# EAGLE design Booster1 (EAGLE 7.5.0)
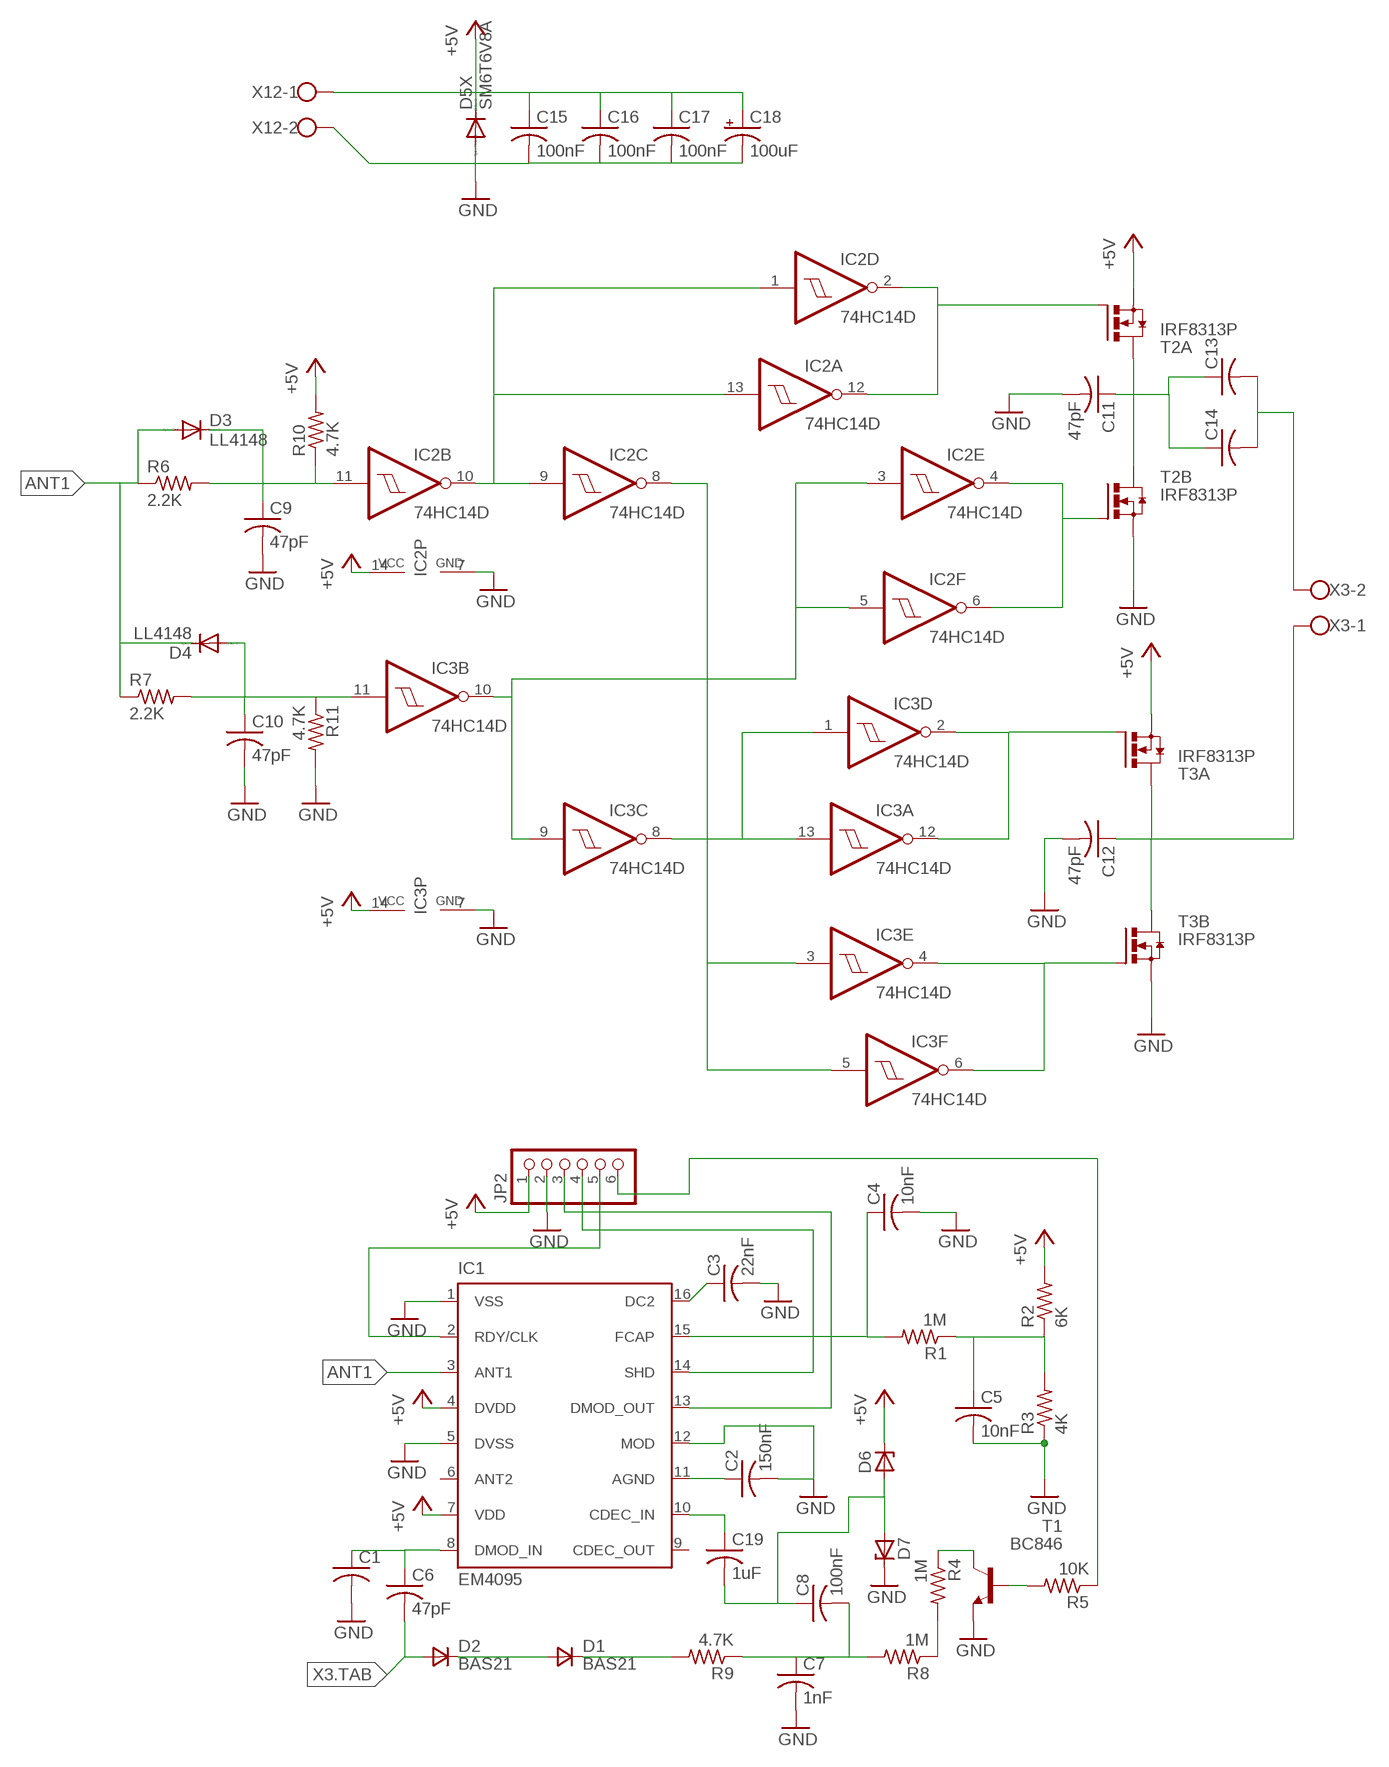
[diagram p0: schematic, sheet 1]

## Parts
C1  C-USC1206K  [C1206K]
C2  150nF  C-USC1206  [C1206]
C3  22nF  C-USC1206K  [C1206K]
C4  10nF  C-USC1206K  [C1206K]
C5  10nF  C-USC1206K  [C1206K]
C6  47pF  C-US050-025X075  [C050-025X075]
C7  1nF  C-US050-025X075  [C050-025X075]
C8  100nF  C-US050-025X075  [C050-025X075]
C9  47pF  C-USC1206  [C1206]
C10  47pF  C-USC1206  [C1206]
C11  47pF  C-USC1206  [C1206]
C12  47pF  C-USC1206  [C1206]
C13  C-US050-025X075  [C050-025X075]
C14  C-US050-025X075  [C050-025X075]
C15  100nF  C-USC1206  [C1206]
C16  100nF  C-USC1206  [C1206]
C17  100nF  C-USC1206  [C1206]
C18  100uF  CPOL-USCT7343  [CT7343]
C19  1uF  C-US050-025X075  [C050-025X075]
D1  BAS21  VAR2SOT23  [SOT-23]
D2  BAS21  VAR2SOT23  [SOT-23]
D3  LL4148  DIODE-SOD106-R  [SOD106-R]
D4  LL4148  DIODE-SOD106-R  [SOD106-R]
D5X  SM6T6V8A  [SMB]
D6  ZENER-DIODESMB  [SMB]
D7  ZENER-DIODESMB  [SMB]
IC1  EM4095  [SO16]
IC2  74HC14D  [SO14]
IC3  74HC14D  [SO14]
JP2  PINHD-1X6  [1X06]
R1  1M  R-US_R1206  [R1206]
R2  6K  R-US_R1206  [R1206]
R3  4K  R-US_R1206  [R1206]
R4  1M  R-US_R1206  [R1206]
R5  10K  R-US_R1206  [R1206]
R6  2.2K  R-US_R1206  [R1206]
R7  2.2K  R-US_R1206  [R1206]
R8  1M  R-US_R1206  [R1206]
R9  4.7K  R-US_R1206  [R1206]
R10  4.7K  R-US_R1206  [R1206]
R11  4.7K  R-US_R1206  [R1206]
T1  BC846  [SOT23]
T2  IRF8313P  [SO-08]
T3  IRF8313P  [SO-08]
X3  W237-102  [W237-102]
X12  W237-102  [W237-102]

## Nets
+5V: C15.1 C16.1 C17.1 C18.+ D5X.C D6.C IC1.4(DVDD) IC1.7(VDD) IC2.14(P:VCC) IC3.14(P:VCC) JP2.1 R2.2 R10.2 T2.3(A:S) T3.3(A:S) X12.1
ANT1: D3.A D4.C IC1.3(ANT1) R6.1 R7.1
BANT2: C12.1 T3.5(A:D) T3.6(A:D) T3.7(B:D) T3.8(B:D) X3.1
DMOD: IC1.13(DMOD_OUT) JP2.3
GND: C1.2 C2.2 C3.2 C4.2 C5.2 C7.2 C9.2 C10.2 C11.2 C12.2 C15.2 C16.2 C17.2 C18.- D5X.A D7.C IC1.1(VSS) IC1.5(DVSS) IC1.12(MOD) IC2.7(P:GND) IC3.7(P:GND) JP2.2 R3.1 R11.2 T1.2(E) T2.1(B:S) T3.1(B:S) X12.2
N$1: C10.1 D4.A IC3.11(B:I) R7.2 R11.1
N$2: IC2.1(D:I) IC2.9(C:I) IC2.10(B:O) IC2.13(A:I)
N$3: D1.3(A) D2.1(C)
N$4: IC2.8(C:O) IC3.3(E:I) IC3.5(F:I)
N$5: IC2.3(E:I) IC2.5(F:I) IC3.9(C:I) IC3.10(B:O)
N$6: IC2.4(E:O) IC2.6(F:O) T2.2(B:G)
N$7: IC2.2(D:O) IC2.12(A:O) T2.4(A:G)
N$8: IC3.1(D:I) IC3.8(C:O) IC3.13(A:I)
N$9: IC3.2(D:O) IC3.12(A:O) T3.4(A:G)
N$10: IC3.4(E:O) IC3.6(F:O) T3.2(B:G)
N$11: C9.1 D3.C IC2.11(B:I) R6.2 R10.1
N$12: C11.1 C13.1 C14.1 T2.5(A:D) T2.6(A:D) T2.7(B:D) T2.8(B:D)
N$13: D1.1(C) R9.2
N$14: C4.1 IC1.15(FCAP) R1.2
N$15: C2.1 IC1.11(AGND)
N$17: C5.1 R1.1 R2.1 R3.2
N$20: C3.1 IC1.16(DC2)
N$22: C19.1 IC1.10(CDEC_IN)
N$23: C7.1 C8.2 R8.2 R9.1
N$24: R4.2 R8.1
N$25: C8.1 C19.2 D6.A D7.A
N$26: R4.1 T1.3(C)
N$27: R5.2 T1.1(B)
N$28: JP2.6 R5.1
RDY: IC1.2(RDY/CLK) JP2.5
SLP: IC1.14(SHD) JP2.4
X3.TAB: C6.2 C13.2 C14.2 D2.3(A) X3.2
XXX: C1.1 C6.1 IC1.8(DMOD_IN)
Unconnected: IC1.6(ANT2) IC1.9(CDEC_OUT)

## Library data of the parts
C1-C17 C19 = rcl:C-US: CAPACITOR, American symbol
C18 = rcl:CPOL-US: POLARIZED CAPACITOR, American symbol
D1 D2 = zetex:VAR2SOT23: DIODE; OC_FARNELL: unknown; OC_NEWARK: unknown
D3 D4 = diode:DIODE-: DIODE
D5X = diode:SM6T6V8A: DIODE super fast rectifier, 2 A
D6 D7 = diode:ZENER-DIODE: Z-Diode
IC1 = em-microelectronic:EM4095: Read/Write analog front end for 125kHz RFID Basestation Source: http://www.emmicroelectronic.com/webfiles/Product/RFID/DS/EM4095_DS.pdf
IC2 IC3 = 74xx-eu:74*14: Hex schmitt trigger INVERTER
JP2 = pinhead:PINHD-1X6: PIN HEADER
R1-R11 = rcl:R-US_: RESISTOR, American symbol
T1 = transistor:BC846: NPN TRANSISTOR
T2 T3 = transistor-power:IRF8313P: HEXFET(R) Power MOSFET Source: Data sheet <http://www.irf.com/product-info/datasheets/data/irf8313pbf.pdf>
X3 X12 = con-wago-500:W237-102: WAGO SCREW CLAMP; MPN: 237-102; OC_FARNELL: unknown; OC_NEWARK: 70K9898

## Board
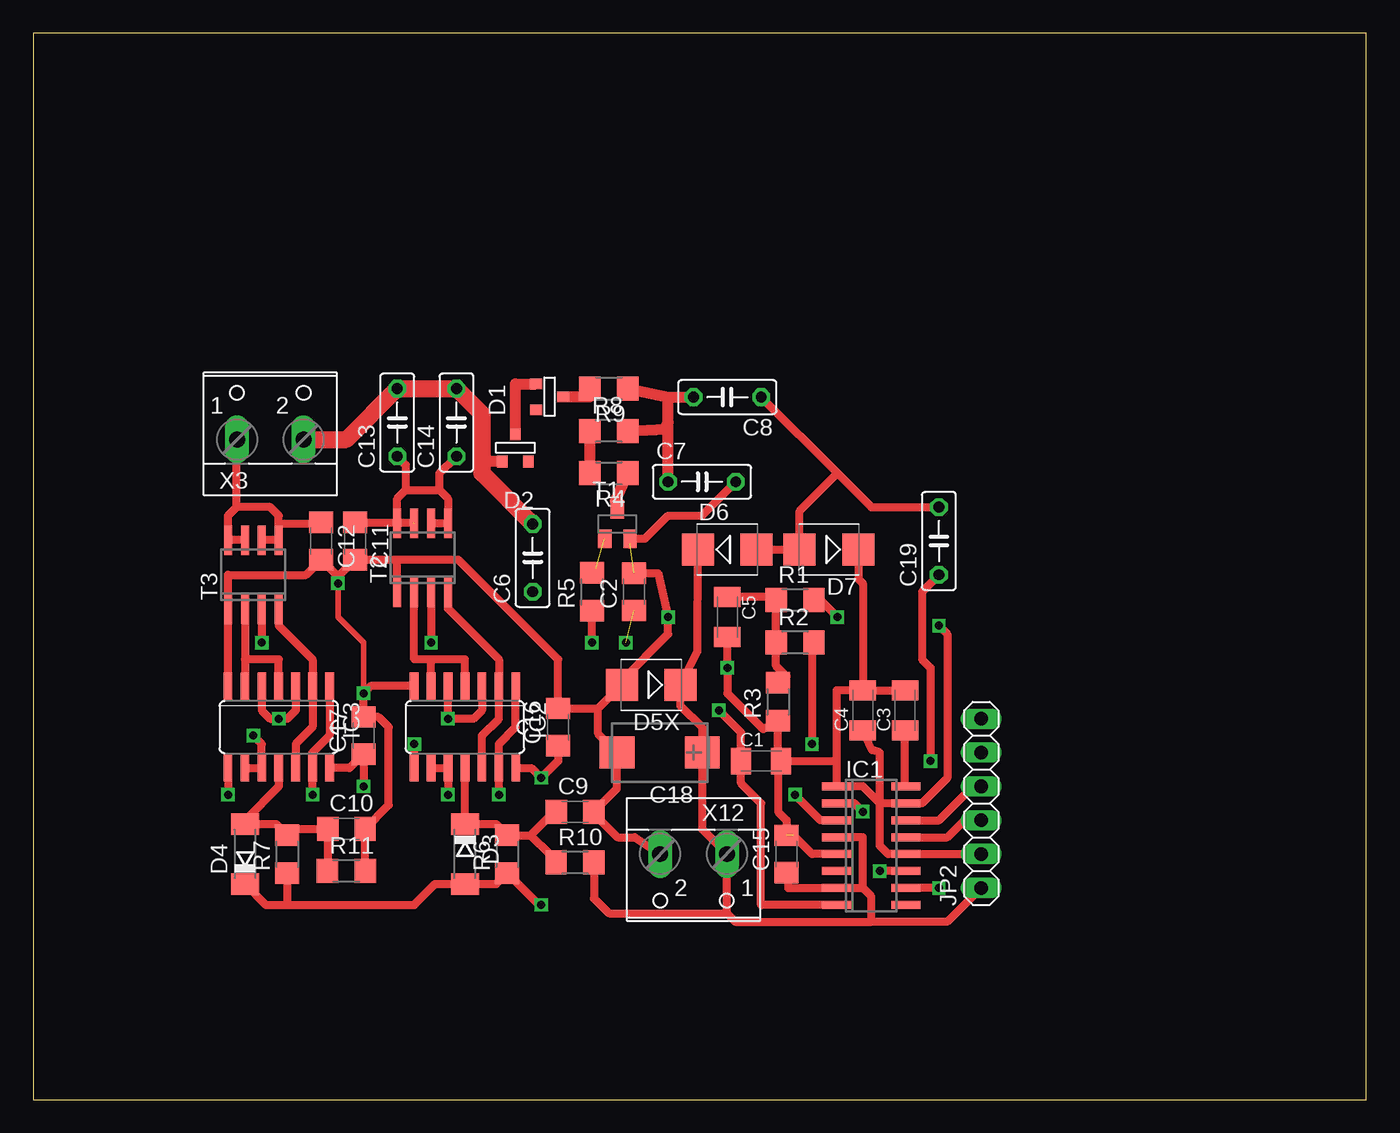
[diagram p1: board, top side]
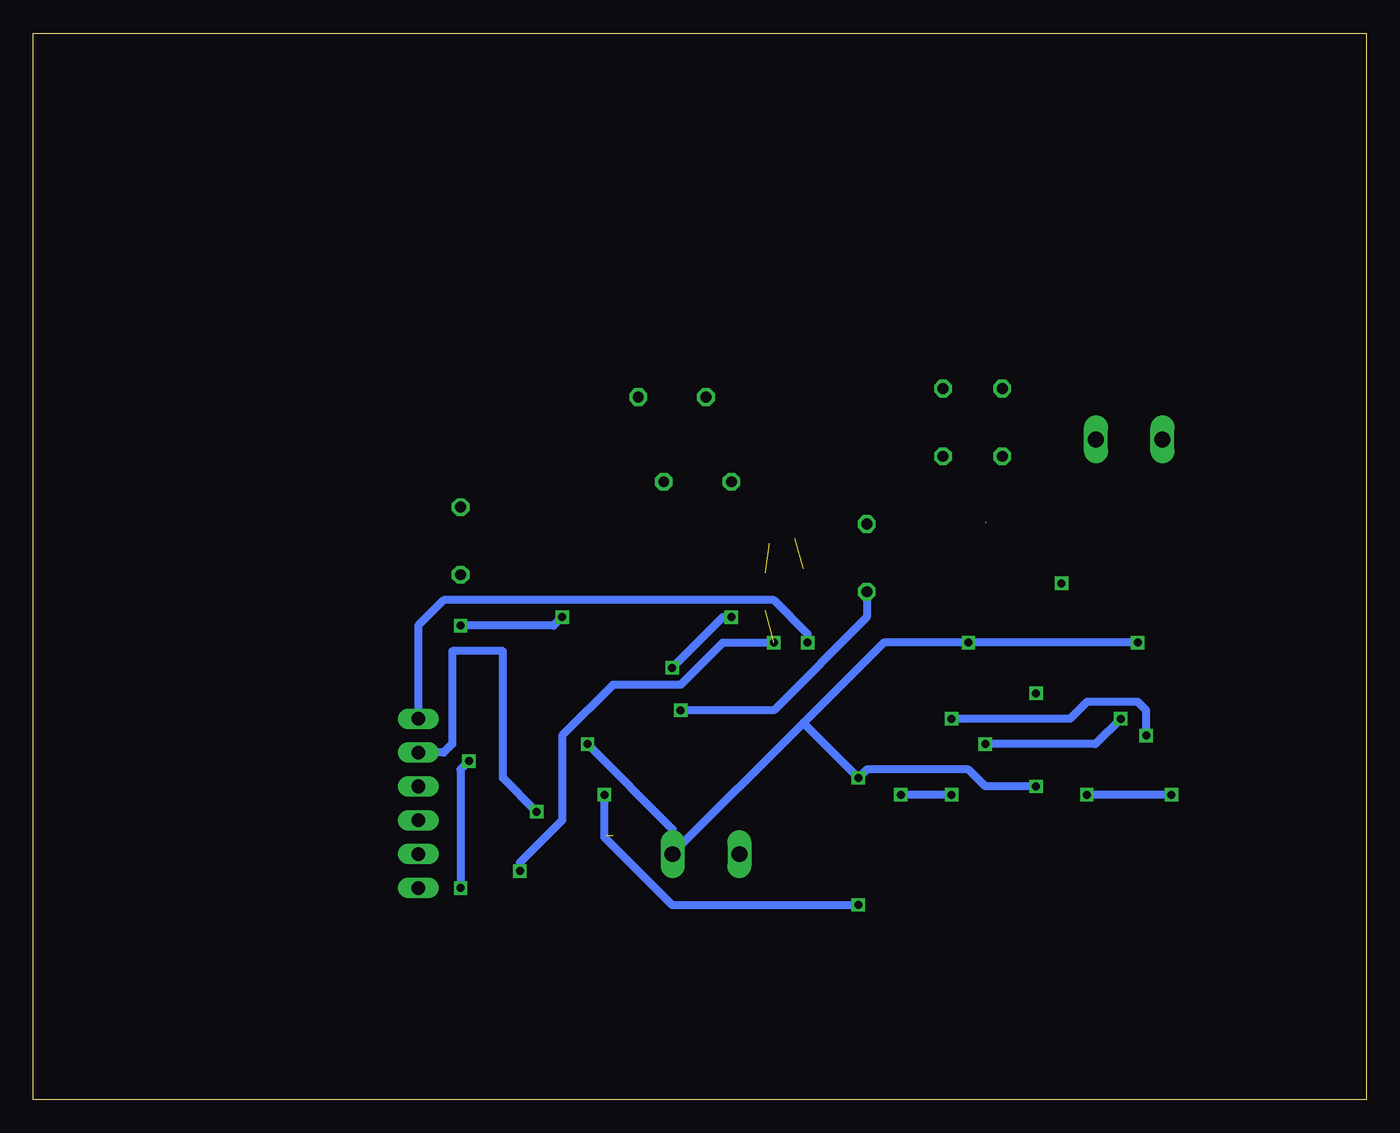
[diagram p2: board, bottom side, seen from below]

Size 100 x 80 mm. Coordinates in mm from the lower left corner, seen from the top.
Outline: 0,0 100,0 100,80 0,80 0,0
Copper layers (1*16): Top 0.035mm / dielectric 1.5mm / Bottom 0.035mm
Design rules "default": minimum track width 10mil, minimum drill 24mil, track to track 8mil, track to pad 8mil, pad to pad 8mil, via to via 8mil, smd to smd 8mil, copper to edge 40mil, drill to drill 8mil, minimum pad ring 10mil, minimum via ring 8mil, stop-mask expansion 4mil, vias tented up to drill 0mil, thermal gap 10mil

### Footprints (pad centres in the part's own frame; a part is rotated, then mirrored left to right if it is on the bottom)
C1206K = smd 1.5 x 2: 1 -1.5,0; 2 1.5,0
C1206 = smd 1.6 x 1.8: 1 -1.4,0; 2 1.4,0
C050-025X075 = drill 0.813 octagon: 1 -2.54,0; 2 2.54,0
CT7343 = smd 2.6 x 2.4: + -3.2,0; - 3.2,0
SOT-23 = smd 0.787 x 0.889: 1 0.025,-1.016; 2 -0.94,1.016; 3 0.991,1.016
SOD106-R = smd 1.6 x 2.1: A 2.25,0; C -2.25,0
SMB = smd 2.4 x 2.4: A 2.2,0; C -2.2,0
SO16 = smd 0.6 x 2.2: 1 -4.445,-2.6; 2 -3.175,-2.6; 3 -1.905,-2.6; 4 -0.635,-2.6; 5 0.635,-2.6; 6 1.905,-2.6; 7 3.175,-2.6; 8 4.445,-2.6; 9 4.445,2.6; 10 3.175,2.6; 11 1.905,2.6; 12 0.635,2.6; 13 -0.635,2.6; 14 -1.905,2.6; 15 -3.175,2.6; 16 -4.445,2.6
SO14 = smd 0.66 x 2.032: 1 -3.81,-3.073; 2 -2.54,-3.073; 3 -1.27,-3.073; 4 0,-3.073; 5 1.27,-3.073; 6 2.54,-3.073; 7 3.81,-3.073; 8 3.81,3.073; 9 2.54,3.073; 10 1.27,3.073; 11 0,3.073; 12 -1.27,3.073; 13 -2.54,3.073; 14 -3.81,3.073
1X06 = drill 1.016 long: 1 -6.35,0; 2 -3.81,0; 3 -1.27,0; 4 1.27,0; 5 3.81,0; 6 6.35,0
R1206 = smd 1.6 x 1.803: 1 -1.422,0; 2 1.422,0
SOT23 = smd 1 x 1.4: 1 -0.95,-1.1; 2 0.95,-1.1; 3 0,1.1
SO-08 = smd 0.6 x 2.2: 1 -1.905,-2.6; 2 -0.635,-2.6; 3 0.635,-2.6; 4 1.905,-2.6; 5 1.905,2.6; 6 0.635,2.6; 7 -0.635,2.6; 8 -1.905,2.6
W237-102 = drill 1.194 long: 1 -2.5,-1.27; 2 2.5,-1.27

### Placement (x,y rotation side)
C1  54.61,25.4 0 top
C2  45.09,38.1 90 top
C3  65.41,29.21 90 top
C4  62.23,29.21 90 top
C5  52.07,36.2 270 top
C6  37.47,40.64 90 top
C7  50.16,46.35 0 top
C8  52.07,52.7 180 top
C9  40.64,21.59 0 top
C10  23.5,20.32 0 top
C11  24.13,41.91 270 top
C12  21.59,41.91 270 top
C13  27.3,50.8 90 top
C14  31.75,50.8 90 top
C15  56.52,18.41 90 top
C16  39.37,27.94 90 top
C17  24.77,27.3 90 top
C18  46.99,26.04 180 top
C19  67.94,41.91 90 top
D1  38.73,52.7 90 top
D2  36.2,48.9 180 top
D3  32.38,18.41 270 top
D4  15.88,18.41 90 top
D5X  46.35,31.11 180 top
D6  52.07,41.27 0 top
D7  59.69,41.27 180 top
IC1  62.87,19.05 270 top
IC2  32.38,27.94 180 top
IC3  18.41,27.94 180 top
JP2  71.12,22.23 90 top
R1  57.15,37.47 0 top
R2  57.15,34.29 0 top
R3  55.88,29.84 90 top
R4  43.18,46.99 180 top
R5  41.91,38.1 90 top
R6  35.56,18.41 90 top
R7  19.05,18.41 90 top
R8  43.18,50.16 0 top
R9  43.18,53.34 180 top
R10  40.64,17.78 0 top
R11  23.5,17.14 0 top
T1  43.81,43.18 0 top
T2  29.21,40.64 0 top
T3  16.51,39.37 0 top
X3  17.78,50.8 0 top
X12  49.53,17.14 180 top

### Tracks (layer width: path | path; a pad name or v marks a point on that pad's centre or on a via)
+5V  (via drill 0.6)
  Top 0.61: T3.3 v17.14,34.29 | IC3.14 23.73,24.87 C17.1 v24.77,23.5 | R10.2 42.06,15.09 43.18,13.97 52.03,13.97 | 50.16,26.01 C18.+ | C18.+ 50.19,27.91 48.55,29.55 D5X.C 49.83,33.61 D6.C | C16.1 39.37,25.4 v38.1,24.13 37.36,24.87 IC2.14 36.2,25.4 | C15.1 56.65,15.88 IC1.7 62.23,15.88 | 62.23,15.88 62.23,19.68 IC1.4 | JP2.1 68.58,13.34 62.87,13.34 | 62.87,13.34 62.87,15.24 62.23,15.88 | T2.3 v29.84,34.29 | C18.+ 50.19,20.25 X12.1 52.03,13.97 | 52.03,13.97 52.66,13.34 62.87,13.34 | R2.2 58.42,34.14 v58.42,26.67
  Bottom 0.61: v17.14,34.29 v29.84,34.29 36.2,34.29 42.23,28.26 | 42.23,28.26 52.03,18.45 X12.1 52.03,20.28 v58.42,26.67 | 42.23,28.26 v38.1,24.13 37.47,24.77 29.84,24.77 28.57,23.5 v24.77,23.5
ANT1  (via drill 0.6)
  Top 0.61: D4.C 17.43,14.61 19.05,14.61 | 19.05,14.61 28.57,14.61 30.14,16.16 D3.A 34.73,16.16 R6.1 37.95,14.61 v38.1,14.61 | R7.1 19.05,14.61 | IC1.3 59.05,20.95 v57.15,22.86
  Bottom 0.61: v38.1,14.61 52.07,14.61 57.15,19.68 v57.15,22.86
BANT2
  Top 0.61: 15.24,44.45 14.61,43.81 T3.8 T3.7 | 15.24,44.45 15.24,49.49 X3.1 | 18.41,43.18 18.41,43.81 17.78,44.45 15.24,44.45 | C12.1 21.46,43.18 18.41,43.18 | T3.6 T3.5 18.41,43.18
DMOD
  Top 0.61: IC1.13 68.58,19.68 69.85,20.95 JP2.3
GND  (via drill 0.6)  (2 unrouted)
  Top 0.406: v24.77,30.48 24.77,34.29 22.86,36.2 v22.86,38.73
  Top 0.61: 22.86,39.24 C12.2 20.45,39.37 14.61,39.37 T3.1 IC3.7 | 22.86,39.24 C11.2 27.3,40.51 | 22.86,39.24 v22.86,38.73 | R11.2 25.4,17.14 24.89,17.65 C10.2 26.67,22.09 26.67,27.94 25.91,28.7 C17.2 v24.77,30.48 25.3,31.01 IC2.7 | 42.38,29.34 C16.2 39.37,33.02 31.88,40.51 27.3,40.51 | 42.38,29.34 D5X.A 44.16,31.45 47.62,34.92 v47.62,36.2 46.86,39.5 C2.2 | 42.38,29.34 42.38,27.45 C18.- 43.79,23.34 C9.2 42.04,21.46 43.81,19.68 45.12,19.68 X12.2 | C4.2 C3.2 | T1.2 45.89,42.08 47.62,43.81 50.16,43.81 C7.2 | D7.C 61.89,39.08 62.23,38.73 C4.2 | C5.2 v52.07,32.38 52.07,30.48 54.76,27.79 R3.1 55.88,25.63 C1.2 | T2.1 27.3,40.51 | JP2.2 IC1.12 64.14,18.41 63.5,19.05 63.5,22.23 62.23,23.5 IC1.1 60.27,25.4 | IC1.5 58.42,18.41 57.02,19.82 | C15.2 56.52,20.95 55.88,21.59 55.88,25.17 56.11,25.17 C1.2 | C4.2 60.27,30.71 60.27,25.4 | C1.2 60.27,25.4
  Top 0.813: 44.77,41.73 T1.2
  Bottom 0.61: v47.62,36.2 48.26,36.2 v52.07,32.38
N$1
  Top 0.61: IC3.11 18.41,23.5 15.88,20.95 D4.A 18.22,20.66 R7.2 19.53,20.32 C10.1 22.07,20.3 R11.1
N$2  (via drill 0.6)
  Top 0.61: IC2.9 IC2.10 v31.11,22.86 | v34.92,22.86 IC2.13 34.92,26.67 36.2,27.94 IC2.1
  Bottom 0.61: v31.11,22.86 v34.92,22.86
N$3
  Top 0.813: D2.1 36.17,53.7 D1.3
N$4  (via drill 0.6)
  Top 0.61: IC3.3 19.68,29.21 19.05,28.57 v18.41,28.57 17.78,28.57 17.14,29.21 IC3.5 | v28.57,26.67 IC2.8
  Bottom 0.61: v18.41,28.57 20.32,26.67 v28.57,26.67
N$5  (via drill 0.6)
  Top 0.61: v16.51,27.3 17.14,26.67 IC3.10 IC3.9 | IC2.5 v31.11,28.57 33.02,28.57 33.66,29.21 IC2.3
  Bottom 0.61: v16.51,27.3 16.51,29.21 17.14,29.84 20.95,29.84 22.23,28.57 v31.11,28.57
N$6
  Top 0.61: IC2.6 29.84,33.02 | 29.84,33.02 28.57,33.02 T2.2 | IC2.4 32.38,33.02 29.84,33.02
N$7
  Top 0.61: T2.4 31.11,36.83 34.92,33.02 IC2.2 34.92,28.57 33.66,27.3 IC2.12
N$8  (via drill 0.6)
  Top 0.61: IC3.1 22.23,27.3 20.95,26.04 IC3.13 v20.95,22.86 | IC3.8 v14.61,22.86
  Bottom 0.61: v14.61,22.86 v20.95,22.86
N$9
  Top 0.61: T3.4 18.41,35.56 20.95,33.02 IC3.2 20.95,27.94 19.68,26.67 IC3.12
N$10
  Top 0.61: T3.2 15.88,33.02 | 15.88,33.02 IC3.6 | IC3.4 18.41,33.02 15.88,33.02
N$11
  Top 0.61: IC2.11 D3.C 34.73,20.66 R6.2 37.31,19.84 | 37.31,19.84 38.73,18.41 38.73,18.26 R10.1 | C9.1 39.07,21.59 37.31,19.84
N$12  (1 unrouted)
  Top 0.61: C11.1 28.5,43.31 | 27.94,45.72 27.3,45.09 T2.8 T2.7 | 27.94,45.72 30.48,45.72 | 30.48,45.72 31.11,45.09 T2.5 T2.6 | C13.1 27.94,47.62 27.94,45.72 | 30.48,45.72 30.48,46.99 C14.1
N$13
  Top 0.813: D1.1 41.73,52.73 R9.2
N$14  (via drill 0.6)
  Top 0.61: C4.1 62.92,26.22 63.5,26.04 63.5,22.23 IC1.15 66.67,22.23 68.58,24.13 68.58,34.92 v67.94,35.56 | R1.2 59.05,37.47 v60.33,36.2
  Bottom 0.61: v60.33,36.2 60.96,35.56 v67.94,35.56
N$15  (via drill 0.6)  (1 unrouted)
  Top 0.61: IC1.11 v63.5,17.14
  Bottom 0.61: v44.45,34.29 48.26,34.29 51.44,31.11 56.52,31.11 60.33,27.3 60.33,20.95 63.5,17.78 v63.5,17.14
N$17
  Top 0.61: R3.2 56.52,31.75 55.73,32.54 R2.1 R1.1 55.5,37.7 C5.1
N$20
  Top 0.61: IC1.16 65.41,23.5 C3.1
N$22  (via drill 0.6)
  Top 0.61: v67.94,15.88 IC1.10 | C19.1 66.67,38.1 66.67,33.02 67.31,32.38 v67.31,25.4
  Bottom 0.61: v67.31,25.4 67.94,24.77 v67.94,15.88
N$23
  Top 0.813: R9.1 47.62,52.7 | 47.62,52.7 C8.2 | C7.1 47.62,50.8 | 47.62,50.8 47.62,52.7 | R8.2 47.47,50.32 47.62,50.8
N$24
  Top 0.813: R4.2 R8.1
N$25
  Top 0.61: C8.1 60.33,46.99 | 60.33,46.99 62.87,44.45 C19.2 | 60.33,46.99 57.49,44.16 D7.A D6.A
N$26
  Top 0.813: T1.3 43.81,44.45 43.66,44.93 R4.1
N$27  (1 unrouted)
  Top 0.813: R5.2 42.23,39.84
N$28  (via drill 0.6)
  Top 0.61: v41.91,34.29 R5.1
  Bottom 0.61: JP2.6 71.12,35.56 69.22,37.47 44.45,37.47 41.91,34.92 v41.91,34.29
RDY  (via drill 0.6)
  Top 0.61: IC1.2 61.59,22.23 v62.23,21.59
  Bottom 0.61: v62.23,21.59 64.77,24.13 64.77,33.66 68.58,33.66 68.58,26.67 69.22,26.04 JP2.5
SLP
  Top 0.61: IC1.14 67.94,20.95 70.48,23.5 JP2.4
X3.TAB
  Top 0.61: 33.66,47.88 33.66,47.62
  Top 0.813: D2.3 33.66,47.88
  Top 1.27: X3.2 23.5,49.53 C13.2 C14.2 33.66,51.44 33.66,47.62 33.66,46.99 C6.2
XXX  (via drill 0.6)
  Top 0.61: IC1.8 54.61,14.61 54.61,22.23 53.11,23.73 C1.1 53.11,27.54 v51.44,29.21
  Bottom 0.61: C6.1 37.47,36.2 44.45,29.21 v51.44,29.21